# EAGLE schematic buck_converter (EAGLE 9.6.2)
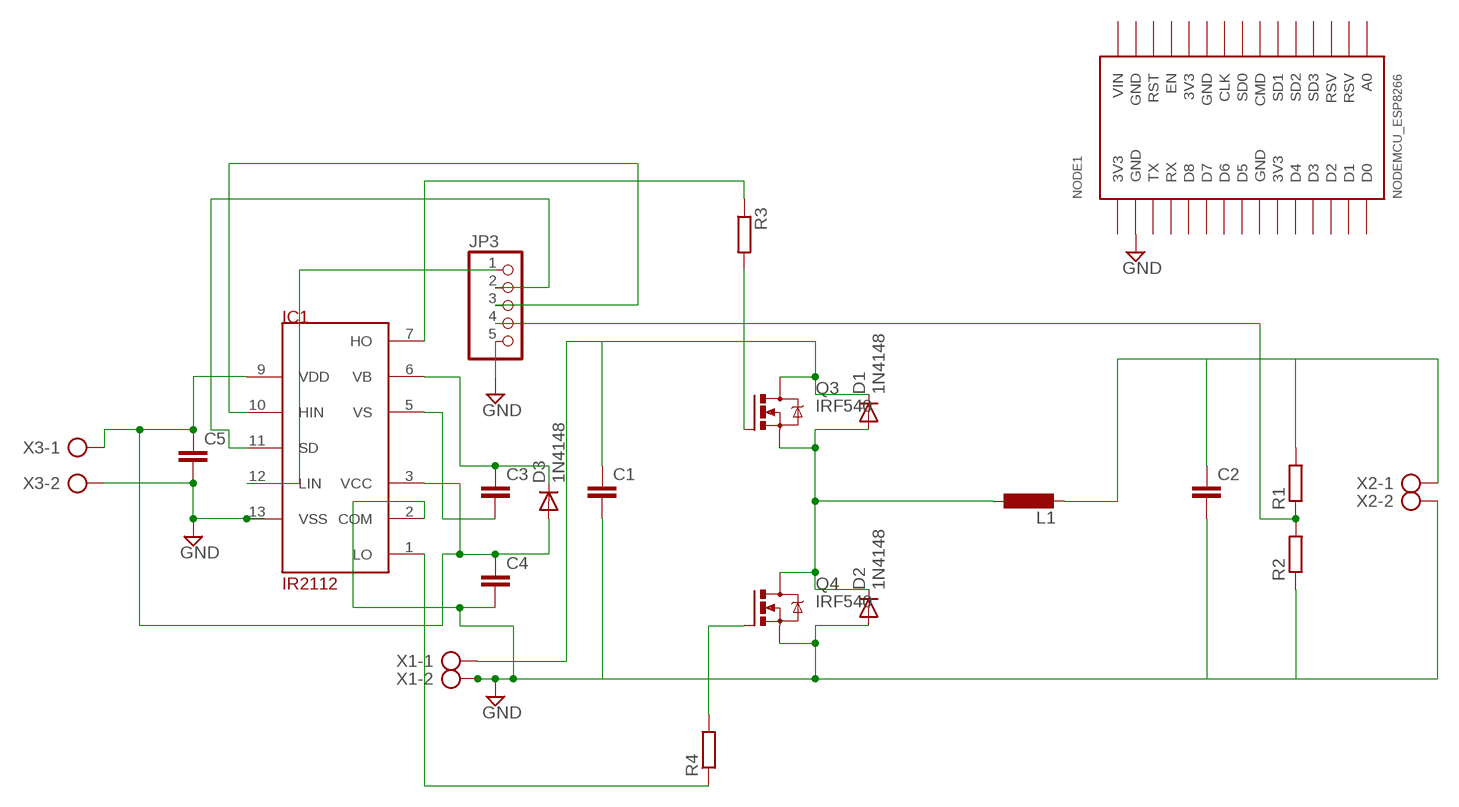
[diagram p0: schematic, sheet 1]

## Parts
C1  C-EU025-060X050  [C025-060X050]
C2  C-EU025-060X050  [C025-060X050]
C3  C-EU025-025X050  [C025-025X050]
C4  C-EU025-025X050  [C025-025X050]
C5  C-EU025-025X050  [C025-025X050]
D1  1N4148  [DO35-10]
D2  1N4148  [DO35-10]
D3  1N4148  [DO35-10]
IC1  IR2112  [DIL14]
JP3  PINHD-1X5  [1X05]
L1  L-EU0207/10  [0207/10]
NODE1  NODEMCU_ESP8266  [NODEMCU_ESP8266]
Q3  IRF540  [TO220BV]
Q4  IRF540  [TO220BV]
R1  R-EU_0207/12  [0207/12]
R2  R-EU_0207/12  [0207/12]
R3  R-EU_0207/12  [0207/12]
R4  R-EU_0207/12  [0207/12]
X1  AK500/2-H  [AK500/2-H]
X2  AK500/2-H  [AK500/2-H]
X3  AK500/2-H  [AK500/2-H]

## Nets
N$1: IC1.10(HIN) JP3.3
N$2: D1.A D2.C L1.1 Q3.S Q4.D
N$3: C1.1 D1.C Q3.D X1.1
N$4: C2.1 L1.2 R1.2 X2.1
N$5: JP3.4 R1.1 R2.2
N$6: IC1.11(SD) JP3.2
N$7: Q3.G R3.2
N$8: IC1.7(HO) R3.1
N$9: IC1.1(LO) R4.1
N$10: IC1.12(LIN) JP3.1
N$11: Q4.G R4.2
SIGNAL: C1.2 C2.2 C4.2 C5.2 D2.A IC1.2(COM) IC1.13(VSS) JP3.5 NODE1.GND@1(GND) Q4.S R2.1 X1.2 X2.2 X3.2 ; supply symbol labelled GND
VB: C3.1 D3.C IC1.6(VB)
VCC: C4.1 C5.1 D3.A IC1.3(VCC) IC1.9(VDD) X3.1
VS: C3.2 IC1.5(VS)
Unconnected: NODE1.A0 NODE1.CLK NODE1.CMD NODE1.D0 NODE1.D1 NODE1.D2 NODE1.D3 NODE1.D4 NODE1.D5 NODE1.D6 NODE1.D7 NODE1.D8 NODE1.EN NODE1.RST NODE1.RSV1(RSV) NODE1.RSV2(RSV) NODE1.RX NODE1.SD1 NODE1.SD2 NODE1.SD3 NODE1.SDO(SD0) NODE1.TX

## Power pins joined to a net without a drawn wire
3V3: NODE1.3V3@1(3V3) NODE1.3V3@2(3V3) NODE1.3V3@3(3V3)
GND: NODE1.GND@2(GND) NODE1.GND@3(GND) NODE1.GND@4(GND)
VIN: NODE1.VIN

## Library data of the parts
C1-C5 = rcl:C-EU: CAPACITOR, European symbol
D1-D3 = diode:1N4148: DIODE high speed (Philips)
IC1 = ir2112:IR2112
JP3 = pinhead:PINHD-1X5: PIN HEADER
L1 = rcl:L-EU: INDUCTOR, European symbol
NODE1 = nodemcu_esp8266:NODEMCU_ESP8266: Node MCU V2 (ESP8266) Created by Harish
Q3 Q4 = transistor-power:IRF540: HEXFET Power MOSFET
R1-R4 = rcl:R-EU_: RESISTOR, European symbol
X1-X3 = con-ptr500:AK500/2-H: CONNECTOR Aug. 2004 / PTR Meßtechnik: Die Bezeichnung der Serie AK505 wurde geändert. Es handelt sich hierbei um AK500 in horizontaler Ausführung.